# Altium schematic sheet GSM.SchDoc
size A; SheetNumber: 4; SheetTotal: 5
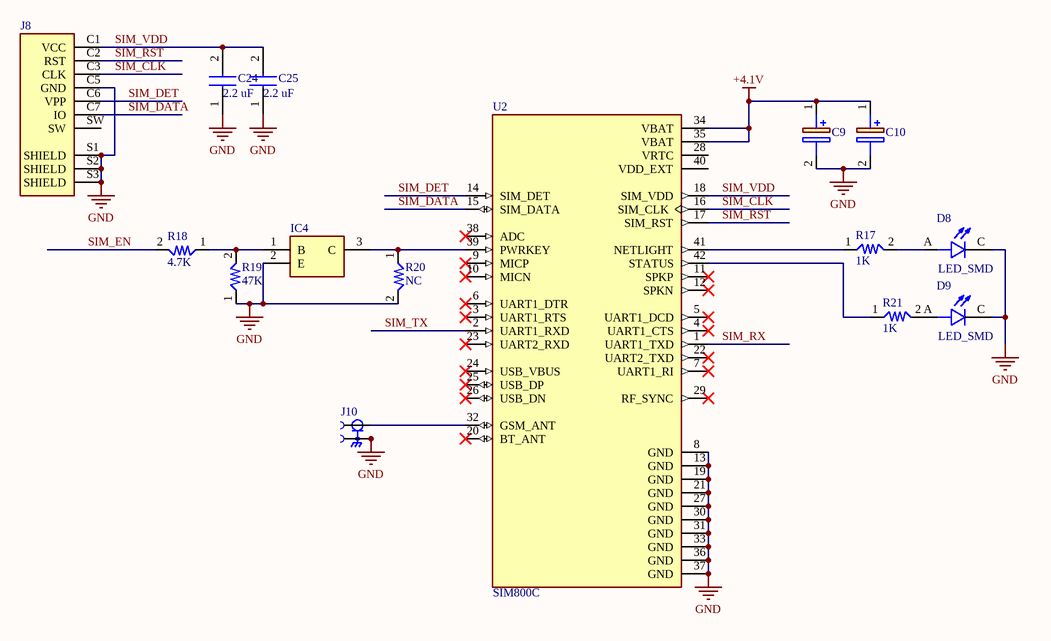
[diagram p0: GSM.SchDoc]

## Parts
C9  TPSD227K010R0100  [CAPPM7344X310N]  (value not drawn)
C10  TPSD227K010R0100  [CAPPM7344X310N]  (value not drawn)
C24  2.2 uF  [CAP0603]
C25  2.2 uF  [CAP0603]
D8  LED_SMD  [LEDSC125X200X90-2N]
D9  LED_SMD  [LEDSC125X200X90-2N]
IC4  MMBT2222ALT1G  [SOT96P237X111-3N]  (value not drawn)
J8  SIM8060-6-1-14-00-A  [GCT_SIM8060-6-1-14-00-A]  (value not drawn)
J10  CONUFL001-SMD  [LINX_CONUFL001-SMD]  (value not drawn)
R17  1K  [RES0603]
R18  4.7K  [RES0603]
R19  47K  [RES0603]
R20  NC  [RES0603]
R21  1K  [RES0603]
U2  SIM800C  [LCC110P1570X1760X250-42N]

## Nets
+4.1V: C9.1(+) C10.1(+) U2.34(VBAT) U2.35(VBAT)
GND: C9.2(-) C10.2(-) C24.1 C25.1 D8.C D9.C IC4.2(E) J8.C5(GND) J8.S1(SHIELD) J8.S2(SHIELD) J8.S3(SHIELD) J10.2 J10.3 R19.1 R20.2 U2.8(GND) U2.13(GND) U2.19(GND) U2.21(GND) U2.27(GND) U2.30(GND) U2.31(GND) U2.33(GND) U2.36(GND) U2.37(GND)
SIM_CLK: J8.C3(CLK) U2.16(SIM_CLK)
SIM_DATA: J8.C7(IO) U2.15(SIM_DATA)
SIM_DET: J8.C6(VPP) U2.14(SIM_DET)
SIM_EN: R18.2
SIM_RST: J8.C2(RST) U2.17(SIM_RST)
SIM_RX: U2.1(UART1_TXD)
SIM_TX: U2.2(UART1_RXD)
SIM_VDD: C24.2 C25.2 J8.C1(VCC) U2.18(SIM_VDD)
NetD8_A: D8.A R17.2
NetD9_A: D9.A R21.2
NetIC4_1: IC4.1(B) R18.1 R19.2
NetIC4_3: IC4.3(C) R20.1 U2.39(PWRKEY)
NetJ10_1: J10.1 U2.32(GSM_ANT)
NetR17_1: R17.1 U2.41(NETLIGHT)
NetR21_1: R21.1 U2.42(STATUS)

Not connected (* = marked no-connect by the designer): J8 SW; U2 3(UART1_RTS)* 4(UART1_CTS)* 5(UART1_DCD)* 6(UART1_DTR)* 7(UART1_RI)* 9(MICP)* 10(MICN)* 11(SPKP)* 12(SPKN)* 20(BT_ANT)* 22(UART2_TXD)* 23(UART2_RXD)* 24(USB_VBUS)* 25(USB_DP)* 26(USB_DN)* 28(VRTC) 29(RF_SYNC)* 38(ADC)* 40(VDD_EXT)

## Library data of the parts
C9 C10 = TPSD227K010R0100: Capacitor Polarised; Manufacturer_Name: Kyocera AVX; Datasheet Link: https://componentsearchengine.com/Datasheets/2/TPSD227K010R0100.pdf; Height: 3.1mm; Manufacturer_Part_Number: TPSD227K010R0100; Mouser Part Number: 581-TPSD227K010R0100; Mouser Price/Stock: https://www.mouser.co.uk/ProductDetail/KYOCERA-AVX/TPSD227K010R0100?qs=VG9BpzG3P7aRGNUSeWjfzQ%3D%3D; Arrow Part Number: TPSD227K010R0100; Arrow Price/Stock: https://www.arrow.com/en/products/tpsd227k010r0100/avx
C24 C25 = CC0603KRX7R9BB104: Capacitor; Manufacturer_Name: YAGEO; Datasheet Link: https://componentsearchengine.com/Datasheets/2/CC0603KRX7R9BB104.pdf; Height: 0.9mm; Manufacturer_Part_Number: CC0603KRX7R9BB104; Mouser Part Number: 603-CC603KRX7R9BB104; Mouser Price/Stock: https://www.mouser.co.uk/ProductDetail/YAGEO/CC0603KRX7R9BB104?qs=vTakOoo5QyLvVCYM2ge8LQ%3D%3D; Arrow Part Number: CC0603KRX7R9BB104; Arrow Price/Stock: https://www.arrow.com/en/products/cc0603krx7r9bb104/yageo?utm_currency=USD&region=europe
D8 D9 = 5990110007F: Red 633nm LED Indication - Discrete 2.1V 0805 (2012 Metric); MF: Dialight; MP: 599-0110-007F; Check_prices: https://www.snapeda.com/parts/599-0110-007F/Dialight/view-part/?ref=eda; Value: *; Purchase-URL: https://pricing.snapeda.com/search/part/599-0110-007F/?ref=eda; Price: None; SnapEDA_Link: https://www.snapeda.com/parts/599-0110-007F/Dialight/view-part/?ref=snap; Availability: In Stock; Package: 0805 Dialight
IC4 = MMBT2222ALT1G: Integrated Circuit; Manufacturer_Name: Rochester Electronics; Datasheet Link: https://www.onsemi.com/pdf/datasheet/mmbt2222lt1-d.pdf; Height: 1.11mm; Manufacturer_Part_Number: MMBT2222ALT1G
J8 = SIM8060-6-1-14-00-A: 6 Position Card Connector NANO SIM Surface Mount, Right Angle Gold; MF: Global Connector Technology; Package: Package Analog Devices; Value: *; Price: None; MP: SIM8060-6-1-14-00-A; SnapEDA_Link: https://www.snapeda.com/parts/SIM8060-6-1-14-00-A/Global%20Connector%20Technology/view-part/3075869/?ref=snap; Availability: Unavailable
J10 = CONUFL001-SMD: MF: Linx; Availability: In Stock; Price: None; SnapEDA_Link: https://www.snapeda.com/parts/CONUFL001-SMD/Linx/view-part/5842340/?ref=snap; Value: *; Check_prices: https://www.snapeda.com/parts/CONUFL001-SMD/Linx/view-part/5842340/?ref=eda; MP: CONUFL001-SMD; Package: None
R17-R21 = RES: Resistor; Manufacturer_Name: UNI-ROYAL(Uniroyal Elec); Manufacturer_Part_Number: 0603WAF1001T5E; Datasheet Link: https://datasheet.lcsc.com/szlcsc/Uniroyal-Elec-0603WAF1001T5E_C21190.pdf; Height: 0.55mm
U2 = SIM800C: Module: GSM/Bluetooth; GPRS; 2G; 1800MHz, 900MHz; 85.6kbps; SMD; MF: Simcom; Check_prices: https://www.snapeda.com/parts/SIM800C/SIMcom+Wireless+solutions+Co.%252CLtd/view-part/?ref=eda; Value: *; Availability: In Stock; MP: SIM800C; Price: None; Package: None; SnapEDA_Link: https://www.snapeda.com/parts/SIM800C/SIMcom+Wireless+solutions+Co.%252CLtd/view-part/?ref=snap